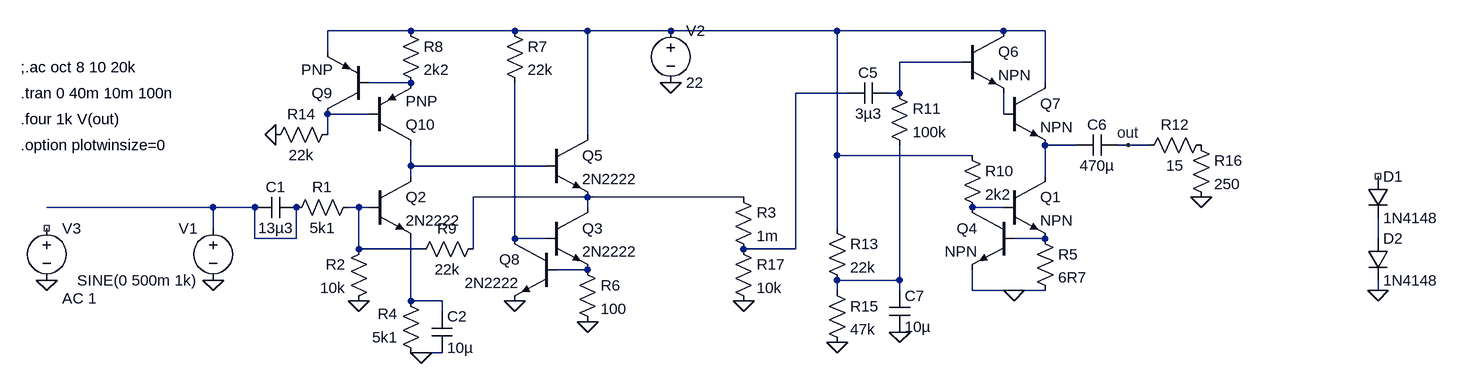
[diagram p0: schematic self_vas.asc]
self_vas.asc, the LTspice schematic file:
Version 4
SHEET 1 1112 680
WIRE -480 -176 -608 -176
WIRE -320 -176 -480 -176
WIRE -208 -176 -320 -176
WIRE -80 -176 -208 -176
WIRE 176 -176 -80 -176
WIRE 432 -176 176 -176
WIRE 496 -176 432 -176
WIRE -608 -144 -608 -176
WIRE 368 -128 272 -128
WIRE -480 -96 -544 -96
WIRE 496 -96 496 -176
WIRE 192 -80 112 -80
WIRE 272 -80 272 -128
WIRE 272 -80 256 -80
WIRE -544 -48 -608 -48
WIRE 432 -48 432 -80
WIRE -608 -16 -608 -48
WIRE -208 -16 -208 -176
WIRE 544 0 496 0
WIRE 624 0 608 0
WIRE 656 0 624 0
WIRE 176 16 176 -176
WIRE 384 16 176 16
WIRE -480 32 -480 0
WIRE -272 32 -480 32
WIRE -480 48 -480 32
WIRE 496 48 496 0
WIRE -208 80 -384 80
WIRE 32 80 -208 80
WIRE -784 96 -1040 96
WIRE -720 96 -784 96
WIRE -560 96 -576 96
WIRE -544 96 -560 96
WIRE -208 96 -208 80
WIRE 432 96 384 96
WIRE -784 128 -784 96
WIRE 176 128 176 16
WIRE -720 144 -720 96
WIRE -656 144 -656 96
WIRE -656 144 -720 144
WIRE -320 144 -320 -96
WIRE -272 144 -320 144
WIRE 496 144 448 144
WIRE 1008 144 1008 112
WIRE -560 160 -560 96
WIRE -464 160 -560 160
WIRE -384 160 -384 80
WIRE 112 160 112 -80
WIRE 112 160 32 160
WIRE -208 192 -256 192
WIRE 272 208 272 0
WIRE 272 208 176 208
WIRE 176 224 176 208
WIRE 272 224 272 208
WIRE 384 224 384 192
WIRE 448 224 384 224
WIRE 496 224 448 224
WIRE 1008 224 1008 208
WIRE -480 240 -480 144
WIRE -432 240 -480 240
WIRE -432 256 -432 240
WIRE -464 320 -480 320
WIRE -432 320 -464 320
FLAG -784 208 0
FLAG -560 240 0
FLAG -464 320 0
FLAG -208 272 0
FLAG 1008 224 0
FLAG -80 -96 0
FLAG 448 224 0
FLAG 736 80 0
FLAG 272 288 0
FLAG 176 304 0
FLAG 32 240 0
FLAG -320 240 0
FLAG -1040 208 0
FLAG -688 -16 0
FLAG 624 0 out
SYMBOL voltage -784 112 M0
WINDOW 123 0 0 Left 0
WINDOW 39 24 124 Left 2
SYMATTR InstName V1
SYMATTR Value SINE(0 500m 1k)
SYMBOL cap -656 80 R90
WINDOW 0 0 32 VBottom 2
WINDOW 3 32 32 VTop 2
SYMATTR InstName C1
SYMATTR Value 13µ3
SYMBOL res -560 80 R90
WINDOW 0 0 56 VBottom 2
WINDOW 3 32 56 VTop 2
SYMATTR InstName R1
SYMATTR Value 5k1
SYMBOL cap -448 256 R0
SYMATTR InstName C2
SYMATTR Value 10µ
SYMBOL res -544 144 M0
SYMATTR InstName R2
SYMATTR Value 10k
SYMBOL res 16 64 R0
SYMATTR InstName R3
SYMATTR Value 1m
SYMBOL npn -544 48 R0
SYMATTR InstName Q2
SYMATTR Value 2N2222
SYMBOL res -464 336 R180
WINDOW 0 36 76 Left 2
WINDOW 3 36 40 Left 2
SYMATTR InstName R4
SYMATTR Value 5k1
SYMBOL npn -272 96 R0
SYMATTR InstName Q3
SYMATTR Value 2N2222
SYMBOL res -224 176 R0
SYMATTR InstName R6
SYMATTR Value 100
SYMBOL res -336 -192 R0
SYMATTR InstName R7
SYMATTR Value 22k
SYMBOL npn -272 -16 R0
SYMATTR InstName Q5
SYMATTR Value 2N2222
SYMBOL res -368 144 R90
WINDOW 0 0 56 VBottom 2
WINDOW 3 32 56 VTop 2
SYMATTR InstName R9
SYMATTR Value 22k
SYMBOL diode 992 48 R0
SYMATTR InstName D1
SYMATTR Value 1N4148
SYMBOL diode 992 144 R0
SYMATTR InstName D2
SYMATTR Value 1N4148
SYMBOL voltage -80 -192 R0
WINDOW 123 0 0 Left 0
WINDOW 39 24 44 Left 2
SYMATTR InstName V2
SYMATTR Value 22
SYMBOL cap 256 -96 R90
WINDOW 0 0 32 VBottom 2
WINDOW 3 32 32 VTop 2
SYMATTR InstName C5
SYMATTR Value 3µ3
SYMBOL npn 432 48 R0
SYMATTR InstName Q1
SYMBOL npn 448 96 M0
SYMATTR InstName Q4
SYMBOL res 480 128 R0
SYMATTR InstName R5
SYMATTR Value 6R7
SYMBOL res 368 0 R0
SYMATTR InstName R10
SYMATTR Value 2k2
SYMBOL cap 608 -16 R90
WINDOW 0 0 32 VBottom 2
WINDOW 3 32 32 VTop 2
SYMATTR InstName C6
SYMATTR Value 470µ
SYMBOL res 256 -96 R0
SYMATTR InstName R11
SYMATTR Value 100k
SYMBOL cap 256 224 R0
SYMATTR InstName C7
SYMATTR Value 10µ
SYMBOL npn 368 -176 R0
SYMATTR InstName Q6
SYMBOL res 752 -16 R90
WINDOW 0 0 56 VBottom 2
WINDOW 3 32 56 VTop 2
SYMATTR InstName R12
SYMATTR Value 15
SYMBOL npn 432 -96 R0
SYMATTR InstName Q7
SYMBOL res 160 112 R0
SYMATTR InstName R13
SYMATTR Value 22k
SYMBOL res 160 208 R0
SYMATTR InstName R15
SYMATTR Value 47k
SYMBOL res 720 -16 R0
SYMATTR InstName R16
SYMATTR Value 250
SYMBOL res 16 144 R0
SYMATTR InstName R17
SYMATTR Value 10k
SYMBOL npn -256 144 M0
SYMATTR InstName Q8
SYMATTR Value 2N2222
SYMBOL voltage -1040 112 R0
WINDOW 123 24 124 Left 2
WINDOW 39 0 0 Left 0
SYMATTR Value2 AC 1
SYMATTR InstName V3
SYMATTR Value ""
SYMBOL pnp -544 -48 R180
SYMATTR InstName Q9
SYMBOL pnp -544 0 M180
SYMATTR InstName Q10
SYMBOL res -496 -192 R0
SYMATTR InstName R8
SYMATTR Value 2k2
SYMBOL res -592 -32 R90
WINDOW 0 0 56 VBottom 2
WINDOW 3 32 56 VTop 2
SYMATTR InstName R14
SYMATTR Value 22k
TEXT -1080 -80 Left 2 !.tran 0 40m 10m 100n
TEXT -1080 -40 Left 2 !.four 1k V(out)
TEXT -1080 0 Left 2 !.option plotwinsize=0
TEXT -1080 -120 Left 2 !;.ac oct 8 10 20k

The netlist it stands for:
* self_vas.asc
V1 N010 0 SINE(0 500m 1k)
C1 N010 N010 13µ3
R1 N011 N010 5k1
C2 N018 0 10µ
R2 N011 0 10k
R3 N009 N004 1m
Q2 N008 N011 N018 0 2N2222
R4 0 N018 5k1
Q3 N009 N013 N016 0 2N2222
R6 N016 0 100
R7 N001 N013 22k
Q5 N001 N008 N009 0 2N2222
R9 N009 N011 22k
D1 NC_01 N015 1N4148
D2 N015 0 1N4148
V2 N001 0 22
C5 N002 N004 3µ3
Q1 N007 N012 N014 0 NPN
Q4 N012 N014 0 0 NPN
R5 N014 0 6R7
R10 N001 N012 2k2
C6 out N007 470µ
R11 N002 N017 100k
C7 N017 0 10µ
Q6 N001 N002 N006 0 NPN
R12 P001 out 15
Q7 N001 N006 N007 0 NPN
R13 N001 N017 22k
R15 N017 0 47k
R16 P001 0 250
R17 N004 0 10k
Q8 N013 N016 0 0 2N2222
V3 NC_02 0 AC 1
Q9 N005 N003 N001 0 PNP
Q10 N008 N005 N003 0 PNP
R8 N001 N003 2k2
R14 N005 0 22k
.model D D
.lib standard.dio
.model NPN NPN
.model PNP PNP
.lib standard.bjt
.tran 0 40m 10m 100n
.four 1k V(out)
.option plotwinsize=0
;.ac oct 8 10 20k
.backanno
.end